# EAGLE design typhon (EAGLE 5.11)
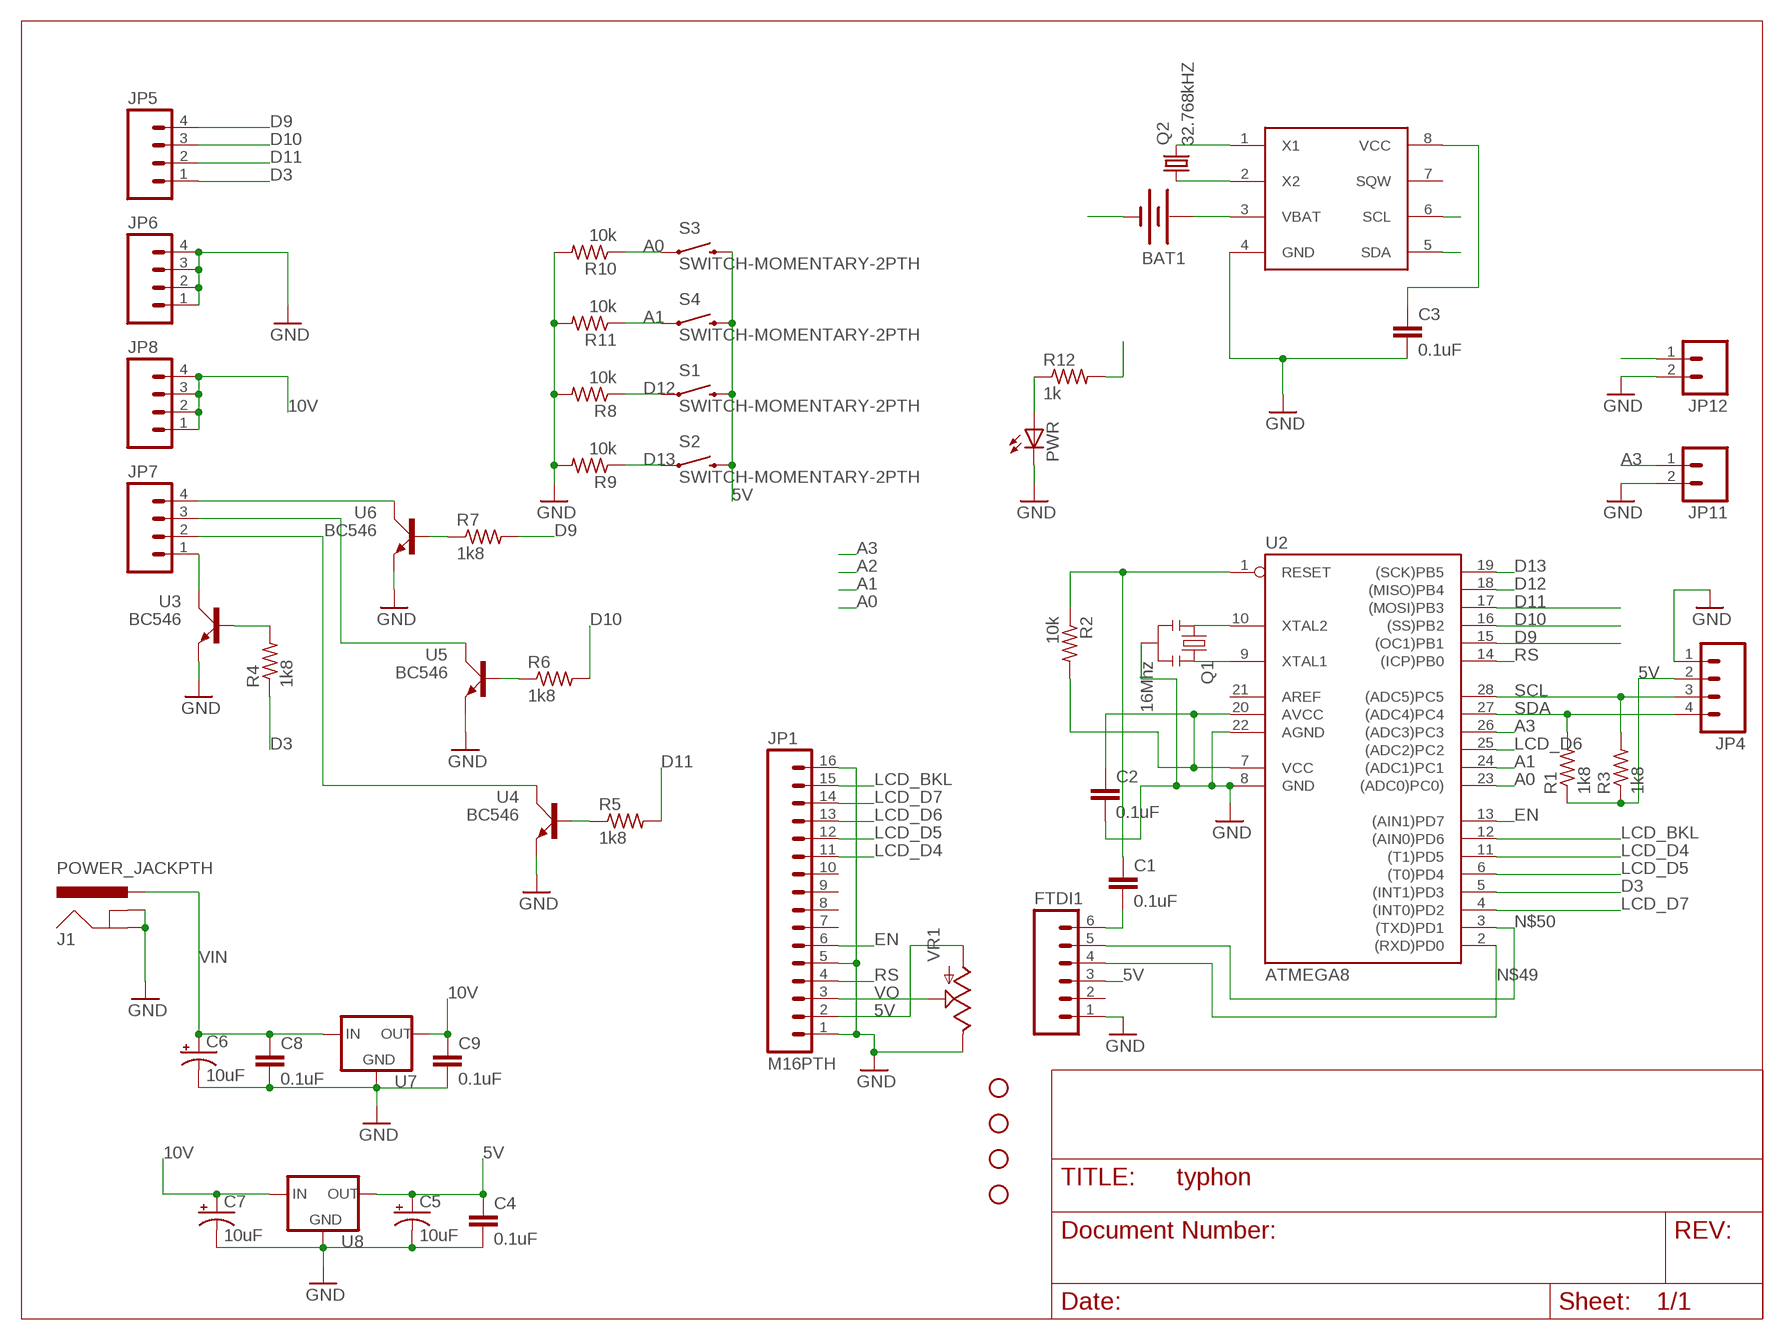
[diagram p0: schematic, sheet 1]

## Parts
BAT1  BATTERY12PTH_KEYSTONE  [BATT_12MM_KEYSTONE]
C1  0.1uF  CAPPTH  [CAP-PTH-SMALL]
C2  0.1uF  CAPPTH  [CAP-PTH-SMALL]
C3  0.1uF  CAPPTH  [CAP-PTH-SMALL]
C4  0.1uF  CAPPTH  [CAP-PTH-SMALL]
C5  10uF  CAP_POL6.3MMPTH  [CAP6.3MM2.5MM]
C6  10uF  CAP_POL6.3MMPTH  [CAP6.3MM2.5MM]
C7  10uF  CAP_POL6.3MMPTH  [CAP6.3MM2.5MM]
C8  0.1uF  CAPPTH  [CAP-PTH-SMALL]
C9  0.1uF  CAPPTH  [CAP-PTH-SMALL]
FTDI1  M06SIP  [1X06]
J1  POWER_JACKPTH  [POWER_JACK_PTH]
JP1  M16PTH  [1X16]
JP2  STAND-OFF  [STAND-OFF]
JP3  STAND-OFF  [STAND-OFF]
JP4  M04PTH  [1X04]
JP5  M04PTH  [1X04]
JP6  M04PTH  [1X04]
JP7  M04PTH  [1X04]
JP8  M04PTH  [1X04]
JP9  STAND-OFF  [STAND-OFF]
JP10  STAND-OFF  [STAND-OFF]
JP11  M02PTH  [1X02]
JP12  M02PTH  [1X02]
PWR  LED3MM  [LED3MM]
Q1  16Mhz  RESONATORPTH  [RESONATOR-PTH]
Q2  32.768kHZ  CRYSTALTC26H  [TC26H]
R1  1k8  R-US_0204/5  [0204/5]
R2  10k  R-US_0204/7  [0204/7]
R3  1k8  R-US_0204/5  [0204/5]
R4  1k8  R-US_0204/7  [0204/7]
R5  1k8  R-US_0204/7  [0204/7]
R6  1k8  R-US_0204/7  [0204/7]
R7  1k8  R-US_0204/7  [0204/7]
R8  10k  R-US_0204/7  [0204/7]
R9  10k  R-US_0204/7  [0204/7]
R10  10k  R-US_0204/7  [0204/7]
R11  10k  R-US_0204/7  [0204/7]
R12  1k  R-US_0204/7  [0204/7]
S1  SWITCH-MOMENTARY-2PTH  [TACTILE-PTH]
S2  SWITCH-MOMENTARY-2PTH  [TACTILE-PTH]
S3  SWITCH-MOMENTARY-2PTH  [TACTILE-PTH]
S4  SWITCH-MOMENTARY-2PTH  [TACTILE-PTH]
U1  DS1307DS1307  [DIP08]
U2  ATMEGA8  AT90S4433P  [DIL28-3]
U3  BC546  [TO92-]
U4  BC546  [TO92-]
U5  BC546  [TO92-]
U6  BC546  [TO92-]
U7  V_REG_78XX  [TO220AHV]
U8  V_REG_78XX  [TO220AHV]
VR1  POT  [TRIM_POT_SIDE]

## Nets
5V [Power]: C2.1 C3.1 C4.1 C5.P$2(+) FTDI1.3 JP1.2 JP4.2 R1.1 R2.2 R3.1 R12.2 S1.3 S2.3 S3.3 S4.3 U1.8(VCC) U2.7(VCC) U2.20(AVCC) U8.E(OUT) VR1.P$3(A)
10V [Power]: C7.P$2(+) C9.1 JP8.1 JP8.2 JP8.3 JP8.4 U7.E(OUT) U8.B(IN)
A0: R10.1 S3.1 U2.23((ADC0)PC0))
A1: R11.1 S4.1 U2.24((ADC1)PC1)
A3: JP11.1 U2.26((ADC3)PC3)
D3: JP5.1 R4.1 U2.5((INT1)PD3)
D9: JP5.4 R7.2 U2.15((OC1)PB1)
D10: JP5.3 R6.2 U2.16((SS)PB2)
D11: JP5.2 R5.2 U2.17((MOSI)PB3)
D12: R8.1 S1.1 U2.18((MISO)PB4)
D13: R9.1 S2.1 U2.19((SCK)PB5)
EN: JP1.6 U2.13((AIN1)PD7)
GND [Power]: BAT1.GND(-) C2.2 C3.2 C4.2 C5.P$1(-) C6.P$1(-) C7.P$1(-) C8.2 C9.2 FTDI1.1 J1.GND J1.GNDBREAK JP1.1 JP1.5 JP1.16 JP4.1 JP6.1 JP6.2 JP6.3 JP6.4 JP11.2 JP12.2 PWR.K(C) Q1.2 R8.2 R9.2 R10.2 R11.2 U1.4(GND) U2.8(GND) U2.22(AGND) U3.3(E) U4.3(E) U5.3(E) U6.3(E) U7.C(GND) U8.C(GND) VR1.P$1(E)
LCD_BKL: JP1.15 U2.12((AIN0)PD6)
LCD_D4: JP1.11 U2.11((T1)PD5)
LCD_D5: JP1.12 U2.6((T0)PD4)
LCD_D6: JP1.13 U2.25((ADC2)PC2)
LCD_D7: JP1.14 U2.4((INT0)PD2)
N$1: Q2.1 U1.2(X2)
N$2: Q2.2 U1.1(X1)
N$3: BAT1.V+(+) U1.3(VBAT)
N$4: PWR.A R12.1
N$5: JP7.1 U3.1(C)
N$6: R4.2 U3.2(B)
N$9: C1.1 R2.1 U2.1(RESET)
N$18: R7.1 U6.2(B)
N$19: JP7.4 U6.1(C)
N$20: R5.1 U4.2(B)
N$21: R6.1 U5.2(B)
N$22: JP7.3 U5.1(C)
N$23: JP7.2 U4.1(C)
N$36: Q1.3 U2.9(XTAL1)
N$38: Q1.1 U2.10(XTAL2)
N$49: FTDI1.4 U2.2((RXD)PD0)
N$50: FTDI1.5 U2.3((TXD)PD1)
N$51: C1.2 FTDI1.6
RS: JP1.4 U2.14((ICP)PB0)
SCL: JP4.3 R3.2 U1.6(SCL) U2.28((ADC5)PC5)
SDA: JP4.4 R1.2 U1.5(SDA) U2.27((ADC4)PC4)
VIN [Power]: C6.P$2(+) C8.1 J1.PWR JP12.1 U7.B(IN)
VO: JP1.3 VR1.P$2(S)
Unconnected: FTDI1.2 JP1.7 JP1.8 JP1.9 JP1.10 U1.7(SQW) U2.21(AREF)

## Library data of the parts
BAT1 = _allyourbase:BATTERY: Battery Holders Various common sizes : AA, AAA, 20mm coin cell and 12mm coin cell.
C1-C4 C8 C9 = _allyourbase:CAP: Capacitor Standard 0603 ceramic capacitor, and 0.1" leaded capacitor.
C5-C7 = _allyourbase:CAP_POL: Capacitor Polarized These are standard SMD and PTH capacitors. Normally 10uF, 47uF, and 100uF in electrolytic and tantalum varieties. Always verify the external diameter of the through hole cap, it varies with capacity, voltage, and manufacturer. The EIA devices should be standard.
FTDI1 = _allyourbase:M06: Header 6 Standard 6-pin 0.1" header. Use with straight break away headers (SKU : PRT-00116), right angle break away headers (PRT-00553), swiss pins (PRT-00743), machine pins (PRT-00117), and female headers (PRT-00115). Molex polarized connector foot print use with SKU : PRT-08094 with associated crimp pins and housings. NOTES ON THE VARIANTS LOCK and LOCK_LONGPADS... This footprint was designed to help hold the alignment of a through-hole component (i.e. 6-pin header) while soldering it into place. You may notice that each hole has been shifted either up or down by 0.005 of an inch from it's more standard position (which is a perfectly straight line). This slight alteration caused the pins (the squares in the middle) to touch the edges of the holes. Because they are alternating, it causes a "brace" to hold the component in place. 0.005 has proven to be the perfect amount of "off-center" position when using our standard breakaway headers. Although looks a little odd when you look at the bare footprint, once you have a header in there, the alteration is very hard to notice. Also, if you push a header all the way into place, it is covered up entirely on the bottom side. This idea of altering the position of holes to aid alignment will be further integrated into the Sparkfun Library for other footprints. It can help hold any component with 3 or more connection pins.
J1 = _allyourbase:POWER_JACK: Power Jack This is the standard 5.5mm barrel jack for power. The PTH is the most common, proven, reliable, footprint. All others are experimental. The Slot footprint only works if the mill layer is transmitted to the PCB fab house so be warned. Spark Fun Electronics SKU : PRT-00119. Mating wall wart : TOL-00298 (and others)
JP1 = _allyourbase:M16
JP2 JP3 JP9 JP10 = _allyourbase:STAND-OFF: Stand Off This is the mechanical footprint for a #4 phillips button head screw. Use the keepout ring to avoid running the screw head into surrounding components. SKU : PRT-00447
JP4-JP8 = _allyourbase:M04: Header 4 Standard 4-pin 0.1" header. Use with straight break away headers (SKU : PRT-00116), right angle break away headers (PRT-00553), swiss pins (PRT-00743), machine pins (PRT-00117), and female headers (PRT-00115). Molex polarized connector foot print use with SKU : PRT-08231 with associated crimp pins and housings.
JP11 JP12 = _allyourbase:M02: Header 2 Standard 2-pin 0.1" header. Use with straight break away headers (SKU : PRT-00116), right angle break away headers (PRT-00553), swiss pins (PRT-00743), machine pins (PRT-00117), and female headers (PRT-00115). Molex polarized connector foot print use with SKU : PRT-08233 with associated crimp pins and housings.
PWR = _allyourbase:LED: LEDs Standard schematic elements and footprints for 5mm, 3mm, 1206, and 0603 sized LEDs. 5mm - Spark Fun Electronics SKU : COM-00529 (and others)
Q1 = _allyourbase:RESONATOR: Resonator Small SMD resonator. This is the itty bitty 10/20MHz resonators with built in caps. CSTCE10M0G55 and CSTCE20M0V53. Footprint has been reviewed closely but hasn't been tested yet.
Q2 = _allyourbase:CRYSTAL: CRYSTAL
R1-R12 = _allyourbase:R-US_: RESISTOR, American symbol
S1-S4 = _allyourbase:SWITCH-MOMENTARY-2
U1 = _allyourbase:DS1307
U2 = atmel:AT90S4433: MICROCONTROLLER 4 Kbytes FLASH 128 bytes SRAM 256 bytes EEPROM UART 6-channel 10 bit ADC
U3-U6 = _allyourbase:BC546
U7 U8 = _allyourbase:V_REG_78XX: Voltage Regulator Standard 7805 5V regulator. IGO (Input Ground Output). Spark Fun Electronics SKU : COM-00107
VR1 = _allyourbase:POT

## Net classes
0 default: width 0.254 mm, drill 0.508 mm
1 Power: width 0.305 mm, drill 0.508 mm

## Board
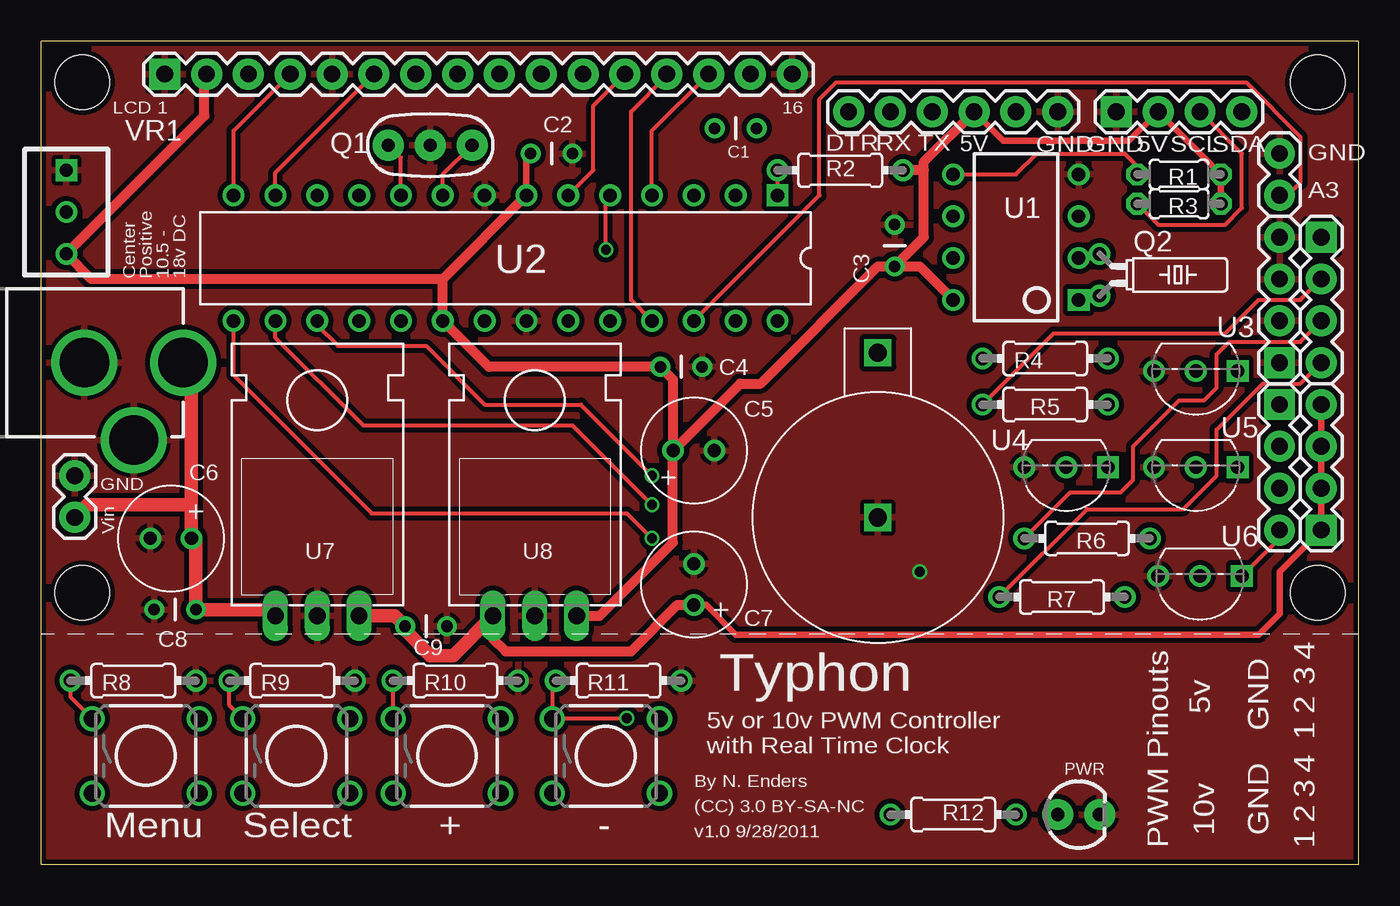
[diagram p1: board, top side]
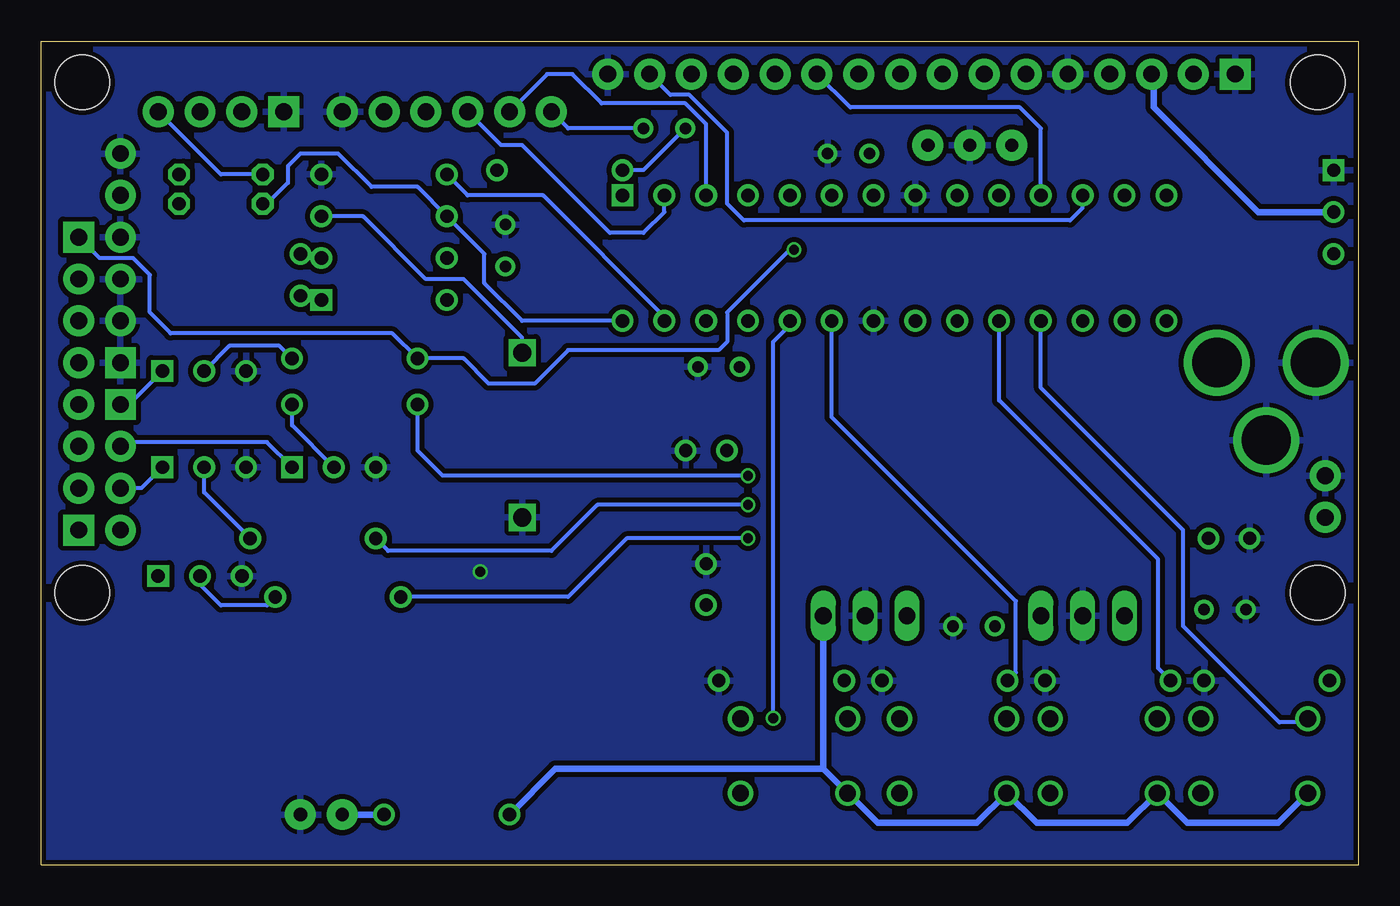
[diagram p2: board, bottom side, seen from below]

Size 80 x 50 mm. Coordinates in mm from the lower left corner, seen from the top.
Outline: 80,0 0,0 0,50 80,50 80,0
Copper layers (1*16): Top 0.035mm / dielectric 1.5mm / Bottom 0.035mm
Design rules "iTead-Seeed-DRC": minimum track width 6mil, minimum drill 12mil, track to track 6mil, track to pad 6mil, pad to pad 6mil, via to via 6mil, smd to smd 0mil, copper to edge 10mil, drill to drill 10mil, minimum pad ring 10mil, minimum via ring 6mil, stop-mask expansion 2mil, vias tented up to drill 100mil, thermal gap 10mil

### Footprints (pad centres in the part's own frame; a part is rotated, then mirrored left to right if it is on the bottom)
BATT_12MM_KEYSTONE = drill 1.1 square: GND 0,0; V+ 10,0
CAP-PTH-SMALL = drill 0.7 round: 1 0,0; 2 2.54,0
CAP6.3MM2.5MM = drill 0.8 round: P$1 -1.25,0; P$2 1.25,0
1X06 = drill 1.016 pad 1.88 round: 1 0,0; 2 2.54,0; 3 5.08,0; 4 7.62,0; 5 10.16,0; 6 12.7,0
POWER_JACK_PTH = drill 2.997 round: GND 0,7.7; GNDBREAK 4.7,10.7; PWR 0,13.7
1X16 = drill 1.016 pad 1.88 square: 1 0,0 | drill 1.016 pad 1.88 round: 2 2.54,0; 3 5.08,0; 4 7.62,0; 5 10.16,0; 6 12.7,0; 7 15.24,0; 8 17.78,0; 9 20.32,0; 10 22.86,0; 11 25.4,0; 12 27.94,0; 13 30.48,0; 14 33.02,0; 15 35.56,0; 16 38.1,0
STAND-OFF = hole 3.302: 0,0
1X04 = drill 1.016 pad 1.88 square: 1 0,0 | drill 1.016 pad 1.88 round: 2 2.54,0; 3 5.08,0; 4 7.62,0
1X02 = drill 1.016 pad 1.88 round: 1 0,0; 2 2.54,0
LED3MM = drill 0.813 pad 1.88 round: A -1.27,0; K 1.27,0
RESONATOR-PTH = drill 0.8 pad 1.88 round: 1 -2.54,0; 2 0,0; 3 2.54,0
TC26H = drill 0.813 round: 1 -1.27,0; 2 1.27,0
0204/5 = drill 0.813 octagon: 1 -2.54,0; 2 2.54,0
0204/7 = drill 0.813 round: 1 -3.81,0; 2 3.81,0
TACTILE-PTH = drill 1.016 round: 1 -3.251,2.261; 2 3.251,2.261; 3 -3.251,-2.261; 4 3.251,-2.261
DIP08 = drill 0.813 square: 1 -3.81,-3.81 | drill 0.813 round: 2 -1.27,-3.81; 3 1.27,-3.81; 4 3.81,-3.81; 5 3.81,3.81; 6 1.27,3.81; 7 -1.27,3.81; 8 -3.81,3.81
DIL28-3 = drill 0.813 square: 1 -16.51,-3.81 | drill 0.813 round: 2 -13.97,-3.81; 3 -11.43,-3.81; 4 -8.89,-3.81; 5 -6.35,-3.81; 6 -3.81,-3.81; 7 -1.27,-3.81; 8 1.27,-3.81; 9 3.81,-3.81; 10 6.35,-3.81; 11 8.89,-3.81; 12 11.43,-3.81; 13 13.97,-3.81; 14 16.51,-3.81; 15 16.51,3.81; 16 13.97,3.81; 17 11.43,3.81; 18 8.89,3.81; 19 6.35,3.81; 20 3.81,3.81; 21 1.27,3.81; 22 -1.27,3.81; 23 -3.81,3.81; 24 -6.35,3.81; 25 -8.89,3.81; 26 -11.43,3.81; 27 -13.97,3.81; 28 -16.51,3.81
TO92- = drill 0.813 square: 1 -2.54,0 | drill 0.813 round: 2 0,0; 3 2.54,0
TO220AHV = drill 1.016 long: B -2.54,-1.905; C 0,-1.905; E 2.54,-1.905
TRIM_POT_SIDE = drill 0.8 square: P$1 0,2.54 | drill 0.8 round: P$2 0,0; P$3 0,-2.54

### Placement (x,y rotation side)
BAT1  50.8,21.08 90 top
C1  40.89,44.7 0 top
C2  29.72,43.18 0 top
C3  51.82,36.32 90 top
C4  37.59,30.23 0 top
C5  39.62,25.15 180 top
C6  7.87,19.81 0 top
C7  39.62,17.02 270 top
C8  9.4,15.49 180 top
C9  22.1,14.48 0 top
FTDI1  61.72,45.72 180 top
J1  -5.08,30.48 270 top
JP1  7.5,48 0 top
JP2  2.5,47.5 0 top
JP3  77.5,47.5 0 top
JP4  65.28,45.72 0 top
JP5  77.72,38.1 270 top
JP6  75.18,30.48 90 top
JP7  75.18,27.94 270 top
JP8  77.72,20.32 90 top
JP9  2.5,16.5 0 top
JP10  77.5,16.5 0 top
JP11  75.18,40.64 90 top
JP12  2.03,21.08 90 top
PWR  62.99,3.05 0 top
Q1  23.62,43.69 0 top
Q2  64.26,35.81 270 top
R1  69.09,41.91 180 top
R2  48.51,42.16 0 top
R3  69.09,40.13 180 top
R4  60.96,30.73 0 top
R5  60.96,27.94 180 top
R6  63.5,19.81 180 top
R7  61.98,16.26 180 top
R8  5.59,11.18 0 top
R9  15.24,11.18 0 top
R10  25.15,11.18 0 top
R11  35.05,11.18 0 top
R12  55.37,3.05 180 top
S1  6.35,6.6 0 top
S2  15.49,6.6 0 top
S3  24.64,6.6 0 top
S4  34.29,6.6 0 top
U1  59.18,38.1 90 top
U2  28.19,36.83 180 top
U3  70.1,29.97 180 top
U4  62.23,24.13 180 top
U5  70.1,24.13 180 top
U6  70.36,17.53 180 top
U7  16.76,17.02 0 top
U8  29.97,17.02 0 top
VR1  1.52,39.62 0 top

### Tracks (layer width: path | path; a pad name or v marks a point on that pad's centre or on a via)
5V
  Top 0.406: U2.7 29.46,42.93 C2.1 | 9.91,47.87 JP1.2 | 38.35,25.13 C5.P$2 | FTDI1.3 58.42,43.94 66.04,43.94 JP4.2 R1.1 R3.1
  Top 0.61: 24.38,35.56 U2.20 27.18,30.23 C4.1 38.37,29.44 C5.P$2 42.44,29.21 43.69,29.21 50.8,36.32 C3.1 | 24.38,35.56 U2.7 | 24.38,35.56 3.05,35.56 VR1.P$3 9.91,45.47 9.91,47.87 | FTDI1.3 53.59,42.67 53.59,42.16 | U8.E 33.91,15.11 38.35,19.56 38.35,25.13 | U1.8 53.34,36.32 C3.1 | 53.59,42.16 53.59,38.1 C3.1 | 53.59,42.16 R2.2
  Bottom 0.406: 32.51,5.82 U8.E | 32.51,5.82 S4.3 31.01,4.34 29.21,2.54 23.19,2.54 S3.3 21.36,4.34 19.56,2.54 14.05,2.54 S2.3 12.22,4.34 10.41,2.54 4.9,2.54 S1.3 | 32.51,5.82 48.79,5.82 R12.2
10V
  Top 0.406: C9.1 22.1,14.22 | JP8.4 JP8.3 JP8.2 JP8.1 75.18,17.78 75.18,15.24 73.91,13.97 42.16,13.97 40.37,15.77 C7.P$2
  Top 0.61: U8.B 27.43,13.72 28.19,12.95 35.81,12.95 38.63,15.77 C7.P$2
  Top 0.813: U7.E 21.46,15.11 C9.1 | 22.1,14.22 23.62,12.7 25.02,12.7 U8.B
A0
  Top 0.254: S3.1 21.39,11.12 R10.1
  Bottom 0.254: U2.23 32,27.18 20.83,16 20.83,11.68 R10.1
A1  (via drill 0.6)
  Top 0.254: 31.06,8.89 v35.56,8.89 | S4.1 31.06,8.89 | 31.06,8.89 31.06,11 R11.1
  Bottom 0.254: U2.24 34.54,32.77 35.56,31.75 v35.56,8.89
A3
  Top 0.254: U2.26 47.24,40.64 47.24,46.48 48.26,47.5 73.15,47.5 76.45,44.2 76.45,41.4 75.69,40.64 JP11.1
D3  (via drill 0.6)
  Top 0.254: U2.5 34.29,40.39 v34.29,37.34
  Bottom 0.254: v34.29,37.34 34.54,37.34 38.35,33.53 38.35,31.75 38.86,31.24 48.01,31.24 50.04,29.21 52.83,29.21 54.36,30.73 R4.1 58.67,32.26 72.14,32.26 73.41,33.53 73.41,35.81 74.42,36.83 76.45,36.83 JP5.1
D9  (via drill 0.6)
  Top 0.254: U2.15 11.68,29.72 20.07,21.34 35.56,21.34 v37.08,19.81 | R7.2 63.5,21.59 69.34,21.59 71.37,23.62 71.37,26.42 74.17,29.21 76.45,29.21 JP5.4
  Bottom 0.254: v37.08,19.81 44.45,19.81 48.01,16.26 R7.2
D10  (via drill 0.6)
  Top 0.254: U2.16 14.22,32 19.56,26.67 32.26,26.67 v37.08,21.84 | R6.2 62.48,22.61 65.53,22.61 66.29,23.37 66.29,25.4 69.09,28.19 70.61,28.19 71.37,28.96 71.37,30.99 72.14,31.75 76.45,31.75 JP5.3
  Bottom 0.254: v37.08,21.84 46.23,21.84 49.02,19.05 58.93,19.05 R6.2
D11  (via drill 0.6)
  Top 0.254: U2.17 16.76,32.77 18.03,31.5 23.37,31.5 26.92,27.94 32.77,27.94 v37.08,23.62 | R5.2 61.47,32.26 71.88,32.26 73.91,34.29 76.45,34.29 JP5.2
  Bottom 0.254: v37.08,23.62 55.63,23.62 57.15,25.15 R5.2
D12
  Top 0.254: R8.1 1.78,10.19 S1.1
  Bottom 0.254: U2.18 19.3,28.96 10.67,20.32 10.67,14.48 4.83,8.64 3.33,8.64 S1.1
D13
  Top 0.254: R9.1 11.43,9.68 S2.1
  Bottom 0.254: U2.19 21.84,28.19 12.19,18.54 12.19,11.94 R9.1
EN
  Top 0.254: U2.13 14.22,42.02 JP1.6
GND  (via drill 0.6)
  other vias: 53.34,17.78
  pour Bottom (isolate 0.305): 0,50.04 80.01,50.04 80.01,0 0,0
  pour Top (isolate 0.305): 0,50.04 0,0 80.26,0 80.01,50.04
LCD_BKL
  Bottom 0.254: U2.12 16.76,39.88 17.53,39.12 37.34,39.12 38.35,40.13 38.35,44.45 40.64,46.74 41.8,46.74 JP1.15
LCD_D4
  Bottom 0.254: U2.11 19.3,44.7 20.57,45.97 30.87,45.97 JP1.11
LCD_D5
  Top 0.254: U2.6 33.53,42.16 33.53,46.09 JP1.12
LCD_D6
  Top 0.254: U2.25 35.81,34.29 35.81,45.72 37.98,47.89 JP1.13
LCD_D7
  Top 0.254: U2.4 37.08,44.56 JP1.14
N$1
  Top 0.305: Q2.1 63.25,37.08 U1.2
N$2
  Top 0.305: U1.1 64.01,34.29 Q2.2
N$3
  Bottom 0.254: BAT1.V+ 50.8,32 54.36,35.56 56.64,35.56 60.45,39.37 U1.3
N$4
  Bottom 0.406: R12.1 PWR.A
N$5
  Bottom 0.254: U3.1 74.68,27.94 JP7.1
N$6
  Bottom 0.254: U3.2 68.58,31.5 65.53,31.5 R4.2
N$9
  Top 0.254: R2.1 U2.1
  Bottom 0.254: R2.1 43.43,42.16 C1.1
N$18
  Bottom 0.254: R7.1 66.29,15.75 69.09,15.75 70.36,17.02 U6.2
N$19
  Top 0.254: U6.1 75.18,19.81 JP7.4
N$20
  Bottom 0.254: U4.2 64.77,26.67 R5.1
N$21
  Bottom 0.254: R6.1 70.1,22.61 U5.2
N$22
  Bottom 0.254: U5.1 73.91,22.86 JP7.3
N$23
  Bottom 0.254: U4.1 66.29,25.65 74.42,25.65 74.68,25.4 JP7.2
N$36
  Top 0.254: U2.9 24.38,41.91 Q1.3
N$38
  Top 0.254: U2.10 21.84,42.93 Q1.1
N$49
  Bottom 0.254: U2.2 42.16,39.62 43.43,38.35 45.47,38.35 50.8,43.69 52.07,43.69 FTDI1.4
N$50
  Bottom 0.254: FTDI1.5 49.28,48.01 47.75,48.01 45.97,46.23 40.89,46.23 39.62,44.96 U2.3
N$51
  Bottom 0.254: C1.2 48.01,44.7 FTDI1.6
RS
  Top 0.254: U2.14 11.68,44.56 JP1.4
SCL
  Top 0.254: JP4.3 72.9,43.18 72.9,39.88 71.88,38.86 67.82,38.86 R3.2
  Bottom 0.254: U2.28 50.8,33.02 53.09,35.31 53.09,37.08 U1.6 57.15,41.15 59.94,41.15 61.98,43.18 64.26,43.18 65.02,42.42 65.02,41.4 66.29,40.13 R3.2
SDA
  Top 0.254: U1.5 59.18,41.91 60.45,43.18 65.79,43.18 66.55,42.42 R1.2
  Bottom 0.254: U2.27 42.16,33.27 49.53,40.64 54.1,40.64 U1.5 | R1.2 69.09,41.91 JP4.4
VIN
  Top 0.813: U7.B 13.84,15.49 C8.1 9.4,19.54 C6.P$2 9.12,21.84 | 9.12,21.84 9.12,29.98 J1.PWR | 9.12,21.84 2.79,21.84 JP12.1
VO
  Bottom 0.406: VR1.P$2 6.1,39.62 12.45,45.97 12.45,47.87 JP1.3

### Text on the board
tNames: LCD 1 | 16 | DTR | RX | TX | 5V | GND | GND | 5V | SCL | SDA | GND | A3 | Center | Positive | 10.5 - | 18v DC | GND | Vin | 4 | Typhon | 3 | 5v | 2 | 5v or 10v PWM Controller | GND | 1 | with Real Time Clock | 4 | By N. Enders | 3 | (CC) 3.0 BY-SA-NC | 2 | Menu | Select | + | - | v1.0 9/28/2011 | 10v | GND | PWM Pinouts | 1